# EAGLE design sensor-suhu (EAGLE 9.6.0)
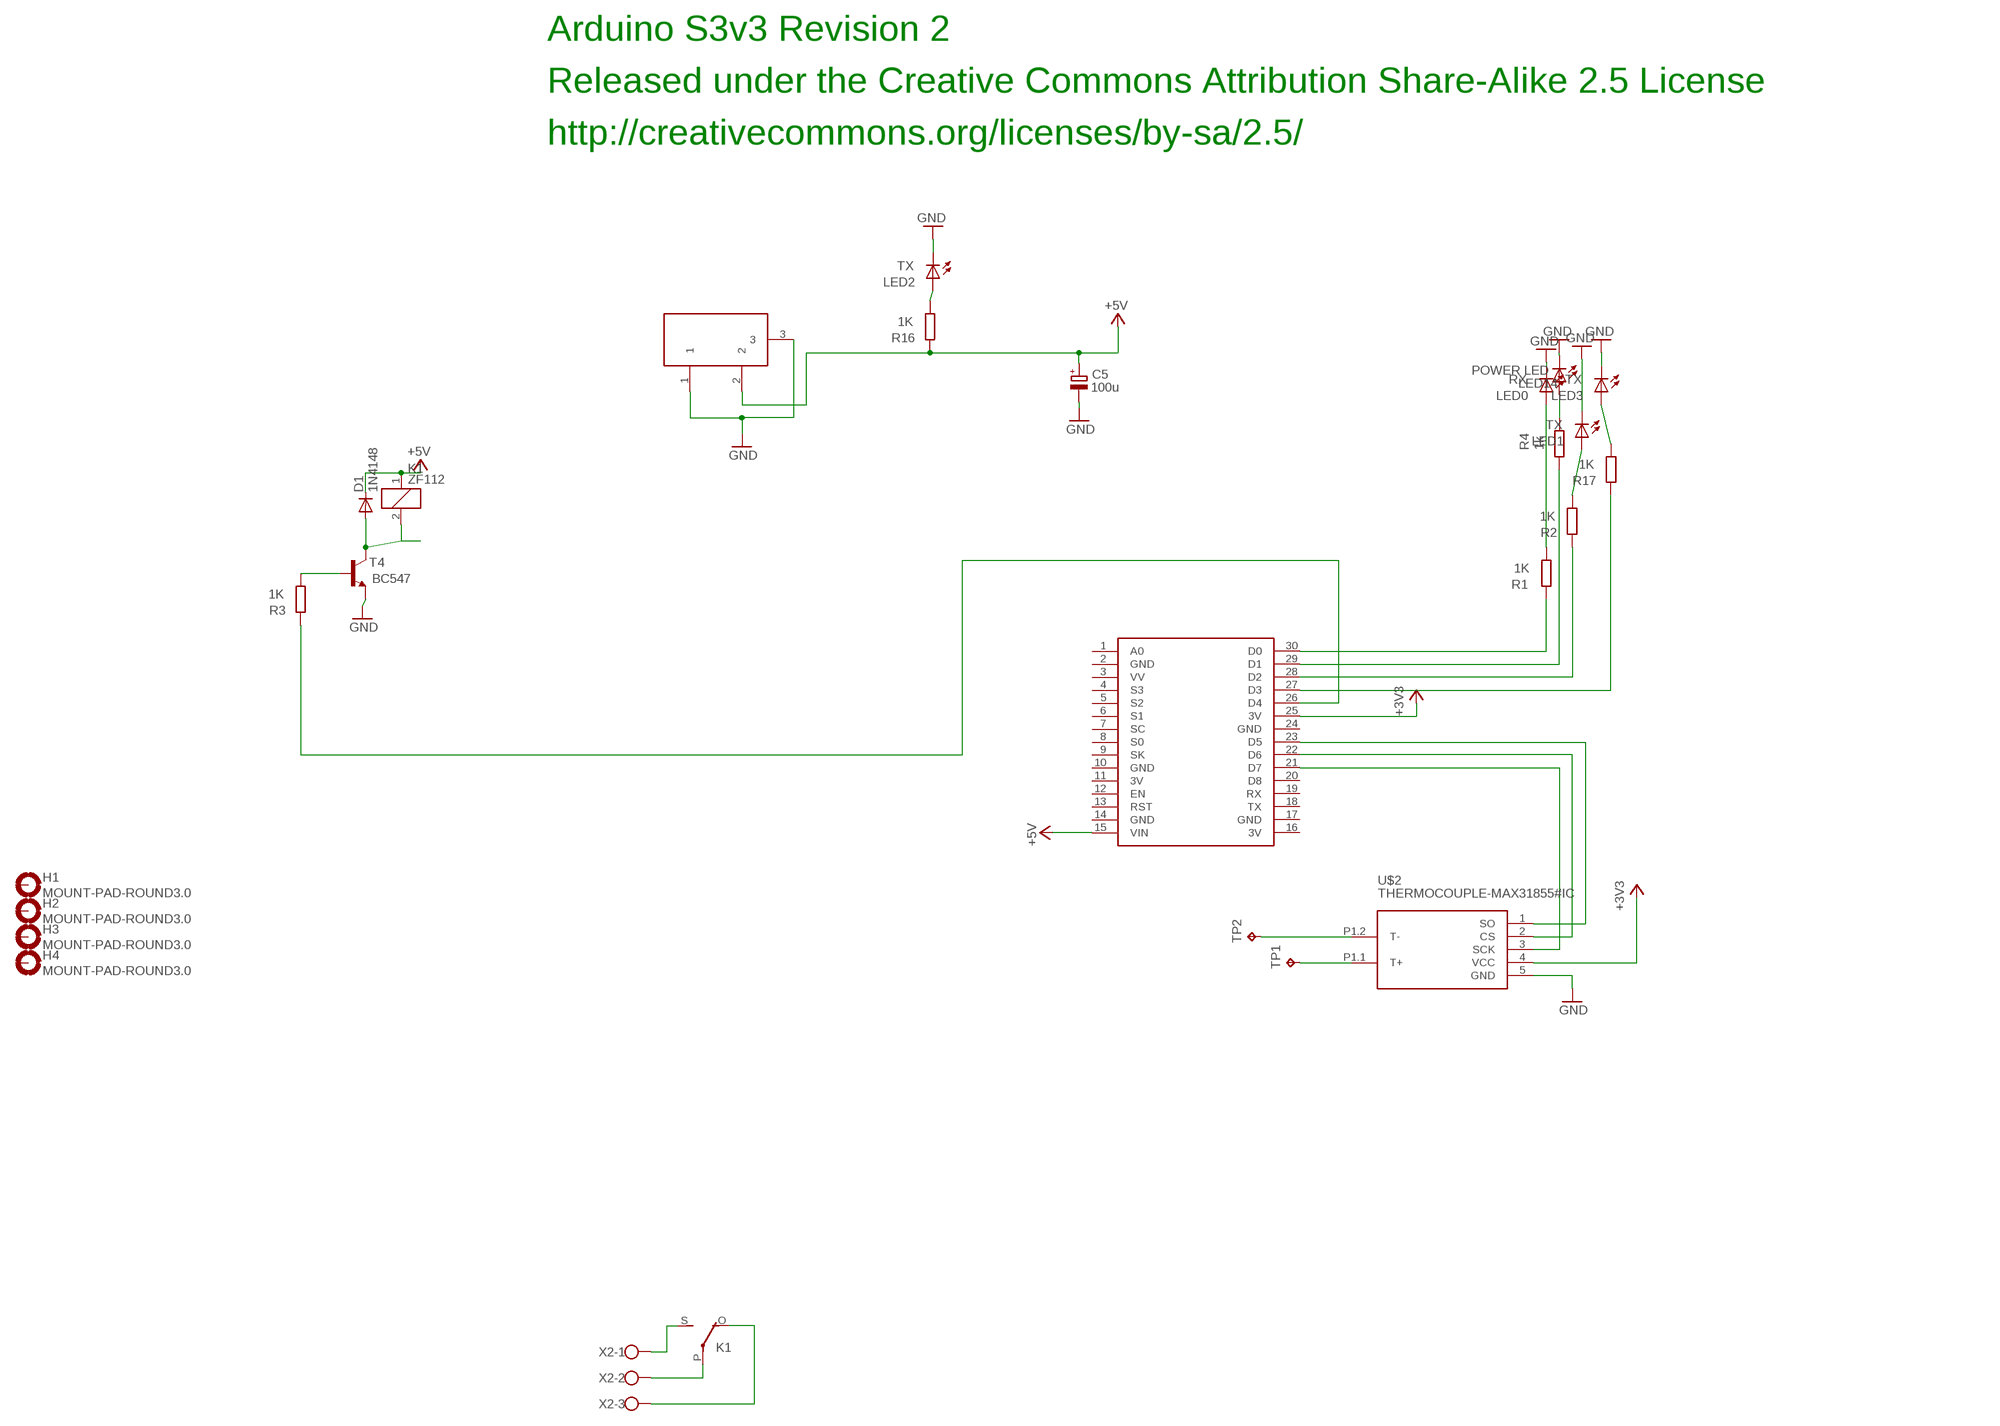
[diagram p0: schematic, sheet 1]

## Parts
C5  100u  CPOL-EUE3.5-8  [E3,5-8]
D1  1N4148  [DO35-10]
DC1  DC21MMX  [DC-21MM]
H1  MOUNT-PAD-ROUND3.0  [3,0-PAD]
H2  MOUNT-PAD-ROUND3.0  [3,0-PAD]
H3  MOUNT-PAD-ROUND3.0  [3,0-PAD]
H4  MOUNT-PAD-ROUND3.0  [3,0-PAD]
K1  ZF112  [ZF112]
LED0  RX  LED5MM  [LED5MM]
LED1  TX  LED5MM  [LED5MM]
LED2  TX  LED5MM  [LED5MM]
LED3  TX  LED5MM  [LED5MM]
LED14  POWER LED  LED5MM  [LED5MM]
R1  1K  R-EU_0207/10  [0207/10]
R2  1K  R-EU_0207/10  [0207/10]
R3  1K  R-EU_0207/10  [0207/10]
R4  1k  R-EU_0207/10  [0207/10]
R16  1K  R-EU_0207/10  [0207/10]
R17  1K  R-EU_0207/10  [0207/10]
T4  BC547  [TO92]
TP1  TPPAD1-17Y  [P1-17Y]
TP2  TPPAD1-17Y  [P1-17Y]
U$1  NODEMCU  [NODEMCU]
U$2  THERMOCOUPLE-MAX31855#IC  [THERMOCOUPLE-MAX31855#IC]
X2  W237-103  [W237-103]

## Nets
+3V3: U$1.25(3V) U$2.4(VCC)
+5V [power]: C5.+ D1.C DC1.2 K1.1 R16.2 U$1.15(VIN)
GND: C5.- DC1.1 DC1.3 LED0.K(C) LED1.K(C) LED2.K(C) LED3.K(C) LED14.K(C) T4.1(E) U$2.5(GND)
N$1: R3.1 T4.2(B)
N$2: K1.O(2:O) X2.3
N$3: LED14.A R4.1
N$4: D1.A K1.2 T4.3(C)
N$5: U$1.23(D5) U$2.1(SO)
N$6: U$1.22(D6) U$2.2(CS)
N$7: U$1.21(D7) U$2.3(SCK)
N$8: K1.S(2:S) X2.1
N$9: K1.P(2:P) X2.2
N$10: R1.2 U$1.30(D0)
N$11: R4.2 U$1.29(D1)
N$12: R2.2 U$1.28(D2)
N$13: R17.2 U$1.27(D3)
N$14: R3.2 U$1.26(D4)
N$15: TP2.TP U$2.P1.2(T-)
N$17: TP1.TP U$2.P1.1(T+)
N$19: LED2.A R16.1
N$21: LED3.A R17.1
N$32: LED1.A R2.1
N$33: LED0.A R1.1
Unconnected: H1.B3,0(MOUNT) H2.B3,0(MOUNT) H3.B3,0(MOUNT) H4.B3,0(MOUNT) U$1.1(A0) U$1.3(VV) U$1.4(S3) U$1.5(S2) U$1.6(S1) U$1.7(SC) U$1.8(S0) U$1.9(SK) U$1.12(EN) U$1.13(RST) U$1.18(TX) U$1.19(RX) U$1.20(D8)

## Notes on the sheet
- Arduino S3v3 Revision 2
- Released under the Creative Commons Attribution Share-Alike 2.5 License
- http://creativecommons.org/licenses/by-sa/2.5/

## Power pins joined to a net without a drawn wire
3V: U$1.11(3V) U$1.16(3V)
GND: U$1.2(GND) U$1.10(GND) U$1.14(GND) U$1.17(GND) U$1.24(GND)

## Library data of the parts
C5 = rcl:CPOL-EU: POLARIZED CAPACITOR, European symbol
D1 = diode:1N4148: DIODE high speed (Philips)
DC1 = powersupply:DC21MM
H1-H4 = holes:MOUNT-PAD-ROUND: MOUNTING PAD, round
K1 = relay:ZF112: RELAY 1 x switch; OC_FARNELL: unknown; OC_NEWARK: unknown
LED0 LED1-LED3 LED14 = led:LED: LED OSRAM: - CHIPLED LG R971, LG N971, LY N971, LG Q971, LY Q971, LO R971, LY R971 LH N974, LH R974 LS Q976, LO Q976, LY Q976 LO Q996 - Hyper CHIPLED LW Q18S LB Q993, LB Q99A, LB R99A - SideLED LS A670, LO A670, LY A670, LG A670, LP A670 LB A673, LV A673, LT A673, LW A673 LH A674 LY A675 LS A676, LA A676, LO A676, LY A676, LW A676 LS A679, LY A679, LG A679 - Hyper Micro SIDELED® LS Y876, LA Y876, LO Y876, LY Y876 LT Y87S - SmartLED LW L88C, LW L88S LB L89C, LB L89S, LG L890 LS L89K, LO L89K, LY L89K LS L896, LA L896, LO L896, LY L896 - TOPLED LS T670, LO T670, LY T670, LG T670, LP T670 LSG T670, LSP T670, LSY T670, LOP T670, LYG T670 LG T671, LOG T671, LSG T671 LB T673, LV T673, LT T673, LW T673 LH T674 LS T676, LA T676, LO T676, LY T676, LB T676, LH T676, LSB T676, LW T676 LB T67C, LV T67C, LT T67C, LS T67K, LO T67K, LY T67K, LW E67C LS E67B, LA E67B, LO E67B, LY E67B, LB E67C, LV E67C, LT E67C LW T67C LS T679, LY T679, LG T679 LS T770, LO T770, LY T770, LG T770, LP T770 LB T773, LV T773, LT T773, LW T773 LH T774 LS E675, LA E675, LY E675, LS T675 LS T776, LA T776, LO T776, LY T776, LB T776 LHGB T686 LT T68C, LB T68C - Hyper Mini TOPLED® LB M676 - Mini TOPLED Santana® LG M470 LS M47K, LO M47K, LY M47K Source: http://www.osram.convergy.de LUXEON: - LUMILED® LXK2-PW12-R00, LXK2-PW12-S00, LXK2-PW14-U00, LXK2-PW14-V00 LXK2-PM12-R00, LXK2-PM12-S00, LXK2-PM14-U00 LXK2-PE12-Q00, LXK2-PE12-R00, LXK2-PE12-S00, LXK2-PE14-T00, LXK2-PE14-U00 LXK2-PB12-K00, LXK2-PB12-L00, LXK2-PB12-M00, LXK2-PB14-N00, LXK2-PB14-P00, LXK2-PB14-Q00 LXK2-PR12-L00, LXK2-PR12-M00, LXK2-PR14-Q00, LXK2-PR14-R00 LXK2-PD12-Q00, LXK2-PD12-R00, LXK2-PD12-S00 LXK2-PH12-R00, LXK2-PH12-S00 LXK2-PL12-P00, LXK2-PL12-Q00, LXK2-PL12-R00 Source: www.luxeon.com KINGBRIGHT: KA-3528ASYC Source: www.kingbright.com
R1-R4 R16 R17 = rcl:R-EU_: RESISTOR, European symbol
T4 = transistor:BC547: NPN TRANSISTOR
TP1 TP2 = testpad:TP: Test pad
U$1 = nodemcu:NODEMCU
U$2 = diy-modules:THERMOCOUPLE-MAX31855#IC: Thermocouple Analog-to-Digital Converter based on MAX31855 chip Symbol with thermocouple connector pins MAX31855 datasheet available here: https://www.maximintegrated.com/en/products/analog/sensors-and-sensor-interface/MAX31855.html Click here to find device on ebay.com <http://www.ebay.com/sch/max31855k+module>
X2 = con-wago-500:W237-103: WAGO SCREW CLAMP; MPN: 237-103; OC_FARNELL: unknown; OC_NEWARK: 18M7116

## Net classes
1 power: width 0.61 mm

## Board
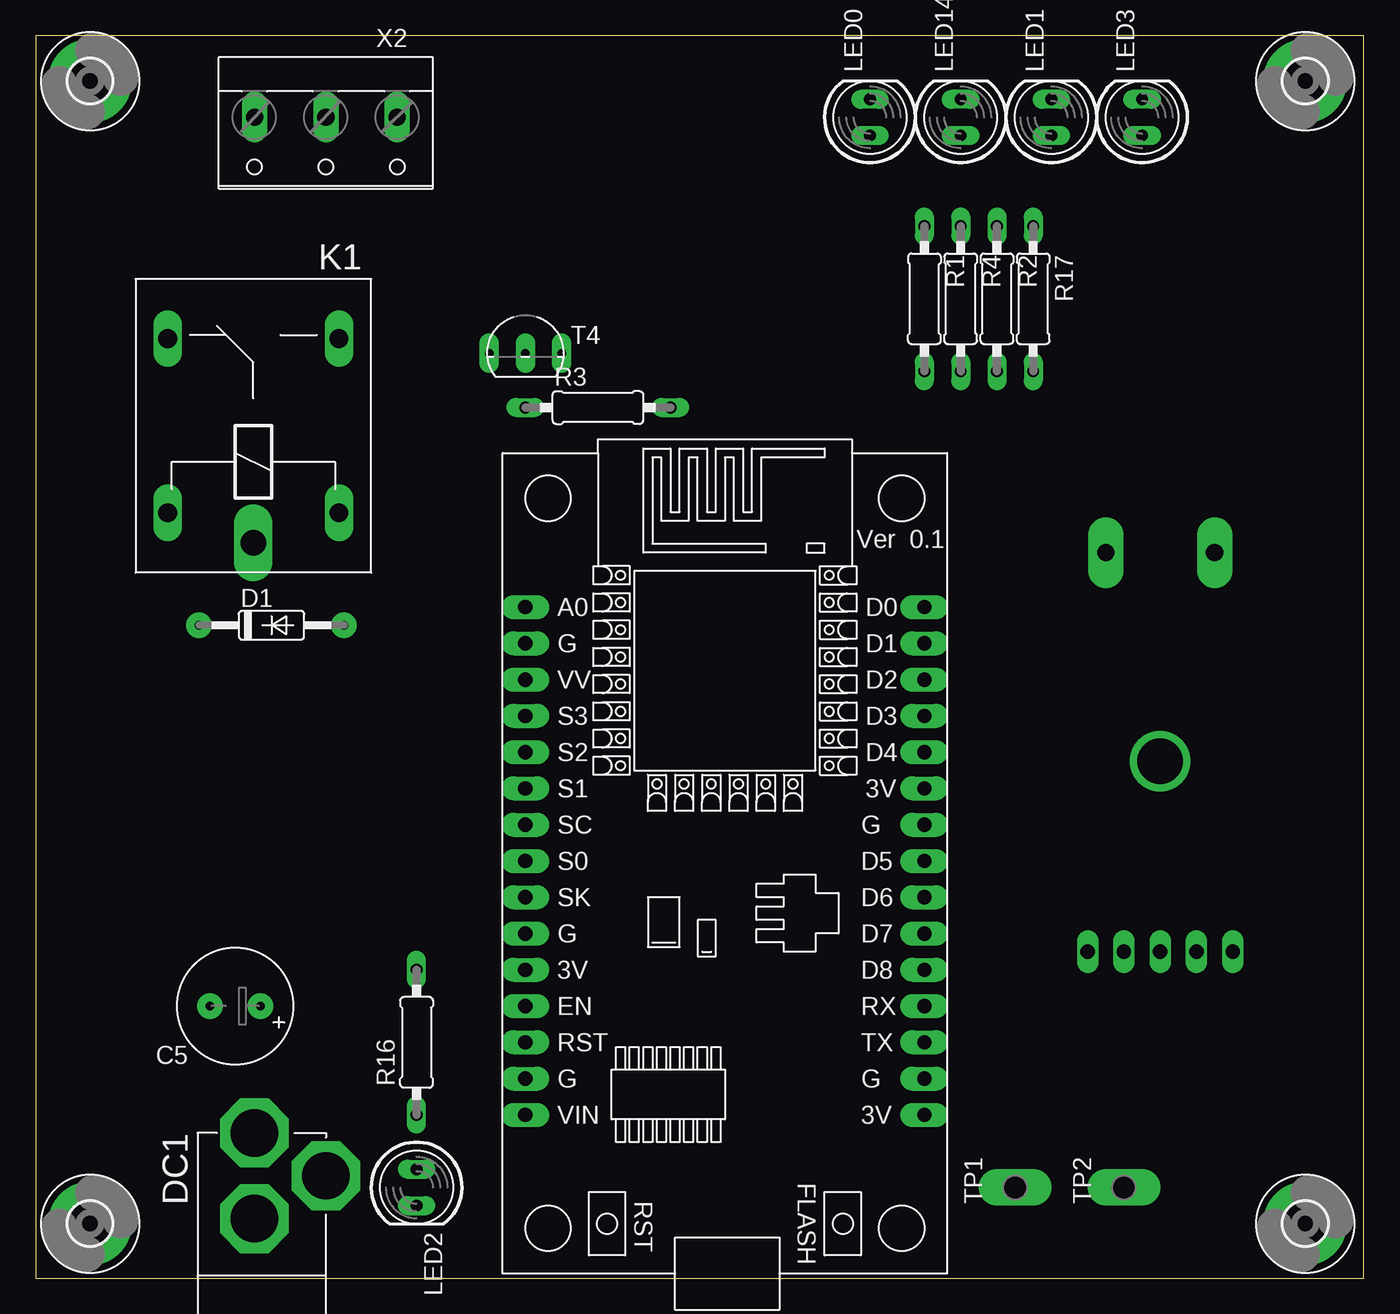
[diagram p1: board, top side]
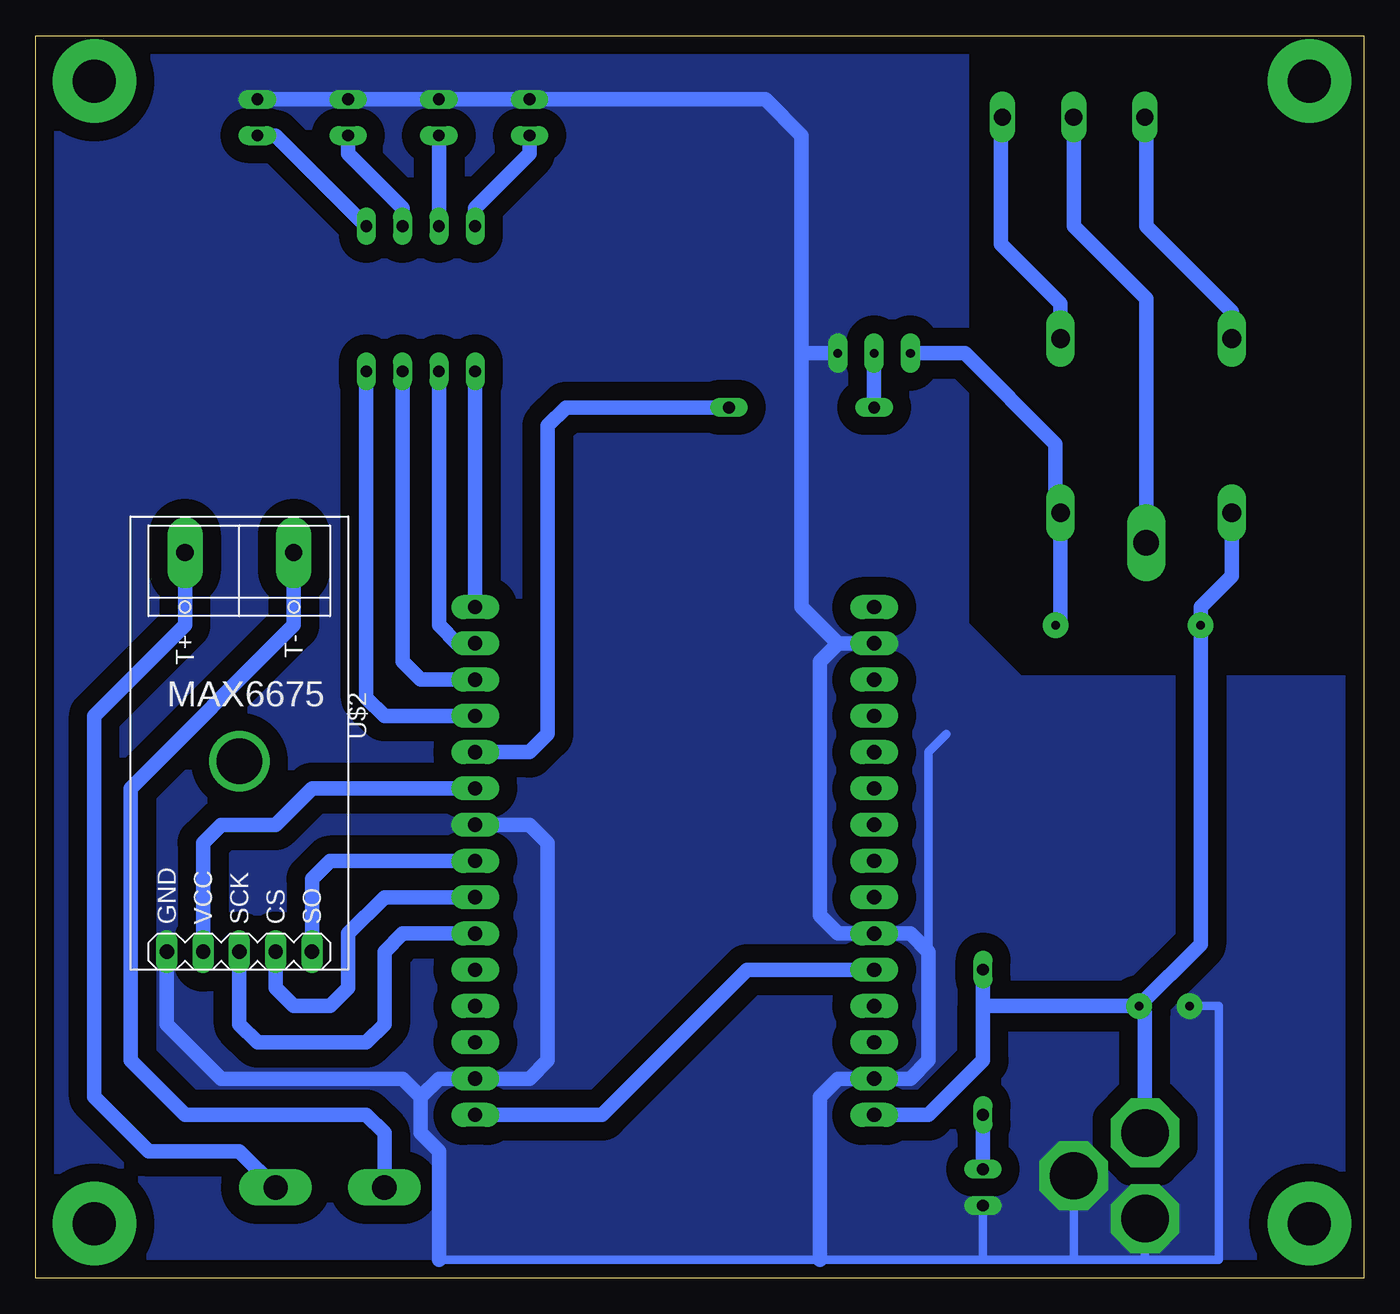
[diagram p2: board, bottom side, seen from below]

Size 93 x 87 mm. Coordinates in mm from the lower left corner, seen from the top.
Outline: 0,0 93,0 93,87 0,87 0,0
Copper layers (1*16): Top 0.035mm / dielectric 1.5mm / Bottom 0.035mm
Design rules "default": minimum track width 10mil, minimum drill 24mil, track to track 8mil, track to pad 8mil, pad to pad 8mil, via to via 8mil, smd to smd 8mil, copper to edge 40mil, drill to drill 8mil, minimum pad ring 10mil, minimum via ring 8mil, stop-mask expansion 4mil, vias tented up to drill 0mil, thermal gap 10mil

### Footprints (pad centres in the part's own frame; a part is rotated, then mirrored left to right if it is on the bottom)
E3,5-8 = drill 0.6 pad 1.778: + -1.778,0; - 1.778,0
DO35-10 = drill 0.6 pad 1.778: A 5.08,0; C -5.08,0
DC-21MM = drill 3.302 pad 4.826 octagon: 1 -5.08,-3.353; 2 -0.076,-6.35; 3 -0.076,-0.356
3,0-PAD = drill 3 pad 5.842: B3,0 0,0
ZF112 = drill 1.321 long: 1 -6.096,5.994; 2 -6.096,-5.994; O 6.096,5.994; S 6.096,-5.994 | drill 1.803 long: P -8.204,0
LED5MM = drill 0.813 long: A -1.27,0; K 1.27,0
0207/10 = drill 0.813 long: 1 -5.08,0; 2 5.08,0
TO92 = drill 0.6 pad 1.372 long: 1 2.54,0; 2 0,0; 3 -2.54,0
P1-17Y = drill 1.702 pad 2.121 long: TP 0,0
NODEMCU = drill 1 pad 1.676 long: 1 -13.97,17.78; 2 -13.97,15.24; 3 -13.97,12.7; 4 -13.97,10.16; 5 -13.97,7.62; 6 -13.97,5.08; 7 -13.97,2.54; 8 -13.97,0; 9 -13.97,-2.54; 10 -13.97,-5.08; 11 -13.97,-7.62; 12 -13.97,-10.16; 13 -13.97,-12.7; 14 -13.97,-15.24; 15 -13.97,-17.78; 16 13.97,-17.78; 17 13.97,-15.24; 18 13.97,-12.7; 19 13.97,-10.16; 20 13.97,-7.62; 21 13.97,-5.08; 22 13.97,-2.54; 23 13.97,0; 24 13.97,2.54; 25 13.97,5.08; 26 13.97,7.62; 27 13.97,10.16; 28 13.97,12.7; 29 13.97,15.24; 30 13.97,17.78
THERMOCOUPLE-MAX31855#IC = drill 1 long: 1 13.97,5.08; 2 13.97,2.54; 3 13.97,0; 4 13.97,-2.54; 5 13.97,-5.08 | drill 1.2 pad 2.5 long: P1.1 -13.97,3.81; P1.2 -13.97,-3.81 | drill 3.2: P$1 0.635,0
W237-103 = drill 1.194 long: 1 -5,-1.29; 2 0,-1.29; 3 5,-1.29

### Placement (x,y rotation side)
C5  13.97,19.05 180 top
D1  16.51,45.72 0 top
DC1  15.24,3.81 180 top
H1  88.9,3.81 0 top
H2  88.9,83.82 0 top
H3  3.81,83.82 0 top
H4  3.81,3.81 0 top
K1  15.24,59.69 90 top
LED0  58.42,81.28 90 top
LED1  71.12,81.28 90 top
LED2  26.67,6.35 270 top
LED3  77.47,81.28 90 top
LED14  64.77,81.28 90 top
R1  62.23,68.58 270 top
R2  67.31,68.58 270 top
R3  39.37,60.96 0 top
R4  64.77,68.58 270 top
R16  26.67,16.51 90 top
R17  69.85,68.58 270 top
T4  34.29,64.77 0 top
TP1  68.58,6.35 90 top
TP2  76.2,6.35 90 top
U$1  48.26,29.21 0 top
U$2  78.74,36.83 270 bottom
X2  20.32,80.01 180 top

### Tracks (layer width: path | path; a pad name or v marks a point on that pad's centre or on a via)
3V
  Bottom 1.016: U$1.11 43.18,21.59 53.34,11.43 U$1.16
+3V3
  Bottom 1.016: U$1.25 73.66,34.29 76.2,31.75 80.01,31.75 81.28,30.48 U$2.4
+5V
  Bottom 1.016: R16.2 26.67,19.05 | 26.67,19.05 C5.+ | DC1.2 15.32,18.62 C5.+ | U$1.15 30.48,11.43 26.67,15.24 26.67,19.05 | K1.1 9.25,49.17 11.43,46.99 D1.C 11.43,23.37 C5.+
GND
  Bottom 0.61: C5.- 10.16,19.05 10.16,1.27 15.24,1.27 | 64.77,1.27 38.1,1.27 26.67,1.27 | 26.67,1.27 20.32,1.27 | 20.32,1.27 15.24,1.27 | DC1.3 15.32,1.35 15.24,1.27 | DC1.1 20.32,1.27 | LED2.K 26.67,1.27 | 29.21,38.1 30.48,36.83 30.48,22.86
  Bottom 1.016: 66.04,12.7 64.77,13.97 U$1.17 58.42,13.97 57.15,15.24 57.15,30.48 58.42,31.75 U$1.24 | 66.04,12.7 66.04,10.16 64.77,8.89 64.77,1.27 | U$1.2 36.83,44.45 | 36.83,44.45 38.1,43.18 38.1,25.4 36.83,24.13 U$1.10 31.75,24.13 30.48,22.86 30.48,15.24 31.75,13.97 U$1.14 36.83,13.97 38.1,12.7 38.1,1.27 | LED3.K LED1.K LED14.K LED0.K 41.91,82.55 39.37,80.01 39.37,64.77 | 39.37,64.77 39.37,46.99 36.83,44.45 | T4.1 39.37,64.77 | U$2.5 83.82,17.78 80.01,13.97 67.31,13.97 66.04,12.7
  pour Bottom (isolate 1.27, no thermals): -1.27,41.91 24.13,41.91 27.94,45.72 27.94,87.63 93.98,87.63 93.98,-1.27 -1.27,-1.27
N$1
  Bottom 1.016: R3.1 T4.2
N$2
  Bottom 1.016: K1.O 9.25,67.67 15.24,73.66 15.24,81.22 X2.3
N$3
  Bottom 1.016: LED14.A R4.1
N$4
  Bottom 1.016: D1.A 21.23,46.08 K1.2 21.59,53.95 21.59,58.42 27.94,64.77 T4.3
N$5
  Bottom 1.016: U$1.23 72.39,29.21 73.66,27.94 U$2.1
N$6
  Bottom 1.016: U$1.22 68.58,26.67 71.12,24.13 71.12,20.32 72.39,19.05 74.93,19.05 76.2,20.32 U$2.2
N$7
  Bottom 1.016: U$1.21 67.31,24.13 68.58,22.86 68.58,17.78 69.85,16.51 77.47,16.51 78.74,17.78 U$2.3
N$8
  Bottom 1.016: K1.S 21.23,68.22 25.4,72.39 25.4,81.22 X2.1
N$9
  Bottom 1.016: K1.P 15.24,68.58 20.32,73.66 X2.2
N$10
  Bottom 1.016: R1.2 U$1.30
N$11
  Bottom 1.016: U$1.29 63.5,44.45 64.77,45.72 R4.2
N$12
  Bottom 1.016: R2.2 67.31,43.18 66.04,41.91 U$1.28
N$13
  Bottom 1.016: U$1.27 68.58,39.37 69.85,40.64 R17.2
N$14
  Bottom 1.016: R3.2 55.88,60.96 57.15,59.69 57.15,38.1 58.42,36.83 U$1.26
N$15
  Bottom 1.016: TP2.TP 78.74,8.89 85.09,8.89 88.9,12.7 88.9,39.37 82.55,45.72 U$2.P1.2
N$17
  Bottom 1.016: U$2.P1.1 74.93,45.72 86.36,34.29 86.36,15.24 82.55,11.43 69.85,11.43 68.58,10.16 TP1.TP
N$19
  Bottom 1.016: R16.1 LED2.A
N$21
  Bottom 1.016: R17.1 76.2,80.01 LED3.A
N$32
  Bottom 1.016: LED1.A 71.12,78.74 69.85,77.47 67.31,74.93 R2.1
N$33
  Bottom 1.016: LED0.A 58.42,78.74 62.23,74.93 R1.1